# Altium project DARKYDEN.PrjPcb (part 13 of 18)

## Sheet BATTERY_GESTION.SchDoc: DARKYDEN_BATTERY_GESTION
size Letter; ApprovedBy: APPROUVÉ PAR; Author: Harold Malbrouck; Organization: Cegep Limoilou; Address1: 1300, 8e Avenue; Address2: Québec, QC; Address3: Canada; Address4: G1J 5L5; Revision: Rev.F; SheetNumber: 17; SheetTotal: 21
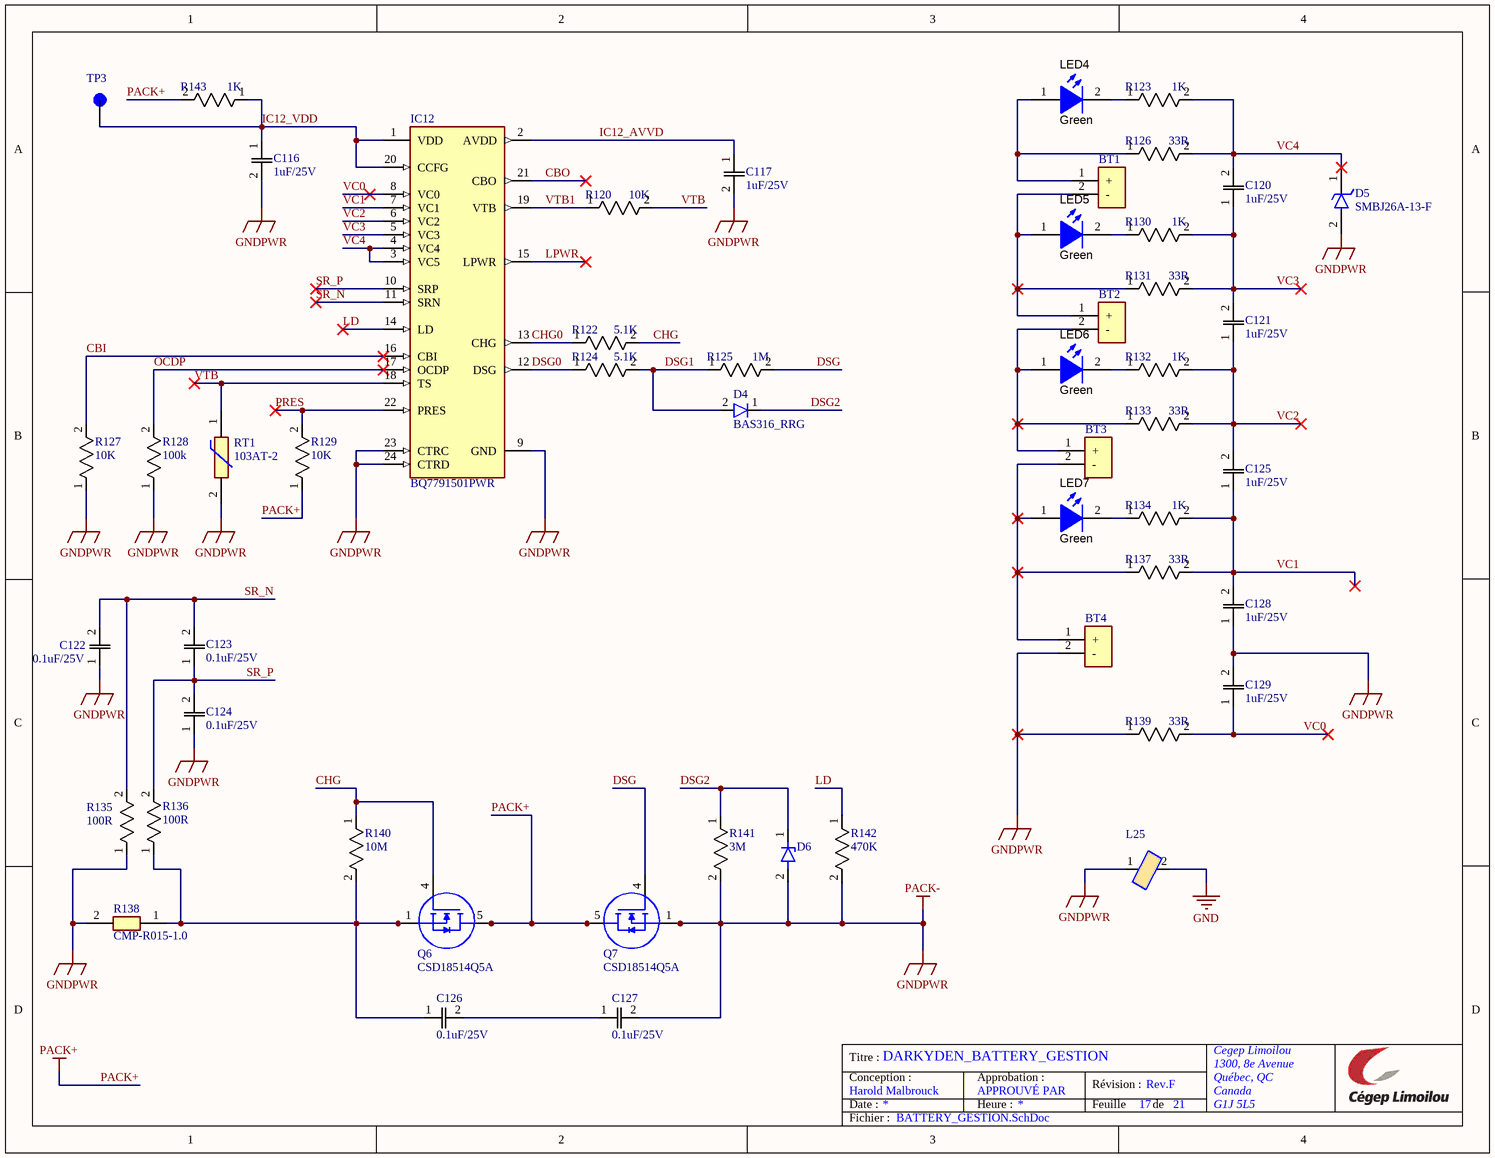
[diagram p12: BATTERY_GESTION.SchDoc]

### Parts
BT1  0530480210  [SHDRRA2W35P0X125_1X2_425X550X350P]  (value not drawn)
BT2  0530480210  [SHDRRA2W35P0X125_1X2_425X550X350P]  (value not drawn)
BT3  0530480210  [SHDRRA2W35P0X125_1X2_425X550X350P]  (value not drawn)
BT4  0530480210  [SHDRRA2W35P0X125_1X2_425X550X350P]  (value not drawn)
C116  1uF/25V  [C0805]
C117  1uF/25V  [C0805]
C120  1uF/25V  [C0805]
C121  1uF/25V  [C0805]
C122  0.1uF/25V  [c0805]
C123  0.1uF/25V  [c0805]
C124  0.1uF/25V  [c0805]
C125  1uF/25V  [C0805]
C126  0.1uF/25V  [c0805]
C127  0.1uF/25V  [c0805]
C128  1uF/25V  [C0805]
C129  1uF/25V  [C0805]
D4  BAS316_RRG  [BAS316RRG]
D5  SMBJ26A-13-F  [DIOM5336X250N]
D6  MMSZ5248B-7-F  [SOD3716X115N]  (value not drawn)
IC12  BQ7791501PWR  [SOP65P640X120-24N]
L25  FBMJ2125HM210NT  [INDC2012X105N]  (value not drawn)
LED4  value Green  [LED_LTST-C190]  (hidden comment: LTST-C190GKT)
LED5  value Green  [LED_LTST-C190]  (hidden comment: LTST-C190GKT)
LED6  value Green  [LED_LTST-C190]  (hidden comment: LTST-C190GKT)
LED7  value Green  [LED_LTST-C190]  (hidden comment: LTST-C190GKT)
Q6  CSD18514Q5A  [CSD18514Q5A]
Q7  CSD18514Q5A  [CSD18514Q5A]
R120  10K  [RESC1608X55N]
R122  5.1K  [RESC1608X55N]
R123  1K  [RESC1608X55N]
R124  5.1K  [RESC1608X55N]
R125  1M  [RESC1608X55N]
R126  33R  [RESC1608X55N]
R127  10K  [RESC1608X55N]
R128  100k  [RESC1608X55N]
R129  10K  [RESC1608X55N]
R130  1K  [RESC1608X55N]
R131  33R  [RESC1608X55N]
R132  1K  [RESC1608X55N]
R133  33R  [RESC1608X55N]
R134  1K  [RESC1608X55N]
R135  100R  [RESC1608X55N]
R136  100R  [RESC1608X55N]
R137  33R  [RESC1608X55N]
R138  CMP-R015-1.0  [RESC5025X70N]
R139  33R  [RESC1608X55N]
R140  10M  [RESC1608X55N]
R141  3M  [RESC1608X55N]
R142  470K  [RESC1608X55N]
R143  1K  [RESC1608X55N]
RT1  103AT-2  [103AT2]
TP3  CHARGE_TP  [KEYSTONE_5006]  (value not drawn)

### Nets
GND: BT4.2(-) C116.2 C117.2 C122.1 C124.1 C127.2 C128.1 C129.2 D5.2(A) D6.2(A) IC12.9(GND) IC12.23(CTRC) IC12.24(CTRD) L25.1 L25.2 Q7.1(S) Q7.2(S_2) Q7.3(S_3) R127.1 R128.1 R135.1 R138.2 R139.1 R141.2 R142.2 RT1.2  [also labelled GNDPWR, PACK-]
PACK+: Q6.5(D) Q6.6(D_2) Q6.7(D_3) Q6.8(D_4) Q6.9(D_5) Q7.5(D) Q7.6(D_2) Q7.7(D_3) Q7.8(D_4) Q7.9(D_5) R129.1 R143.2
CBI: IC12.16(CBI) R127.2
CBO: IC12.21(CBO)
CHG: Q6.4(G) R122.2 R140.1
CHG0: IC12.13(CHG) R122.1
DSG: Q7.4(G) R125.2
DSG0: IC12.12(DSG) R124.1
DSG1: D4.2(A) R124.2 R125.1
DSG2: D4.1(K) D6.1(K) R141.1
IC12_AVVD: C117.1 IC12.2(AVDD)
IC12_VDD: C116.1 IC12.1(VDD) IC12.20(CCFG) R143.1 TP3.TP
LD: IC12.14(LD) R142.1
LPWR: IC12.15(LPWR)
OCDP: IC12.17(OCDP) R128.2
PRES: IC12.22(PRES) R129.2
SR_N: C122.2 C123.2 IC12.11(SRN) R135.2
SR_P: C123.1 C124.2 IC12.10(SRP) R136.2
VC0: C129.1 IC12.8(VC0) R139.2
VC1: C125.1 C128.2 IC12.7(VC1) R134.2 R137.2
VC2: C121.1 C125.2 IC12.6(VC2) R132.2 R133.2
VC3: C120.1 C121.2 IC12.5(VC3) R130.2 R131.2
VC4: C120.2 D5.1(K) IC12.3(VC5) IC12.4(VC4) R123.2 R126.2
VTB: IC12.18(TS) R120.2 RT1.1
VTB1: IC12.19(VTB) R120.1
NetBT1_1: BT1.1(+) LED4.1(A) R126.1
NetBT1_2: BT1.2(-) BT2.1(+) LED5.1(A) R131.1
NetBT2_2: BT2.2(-) BT3.1(+) LED6.1(A) R133.1
NetBT3_2: BT3.2(-) BT4.1(+) LED7.1(A) R137.1
NetC126_1: C126.1 Q6.1(S) Q6.2(S_2) Q6.3(S_3) R136.1 R138.1 R140.2
NetC126_2: C126.2 C127.1
NetLED4_2: LED4.2(K) R123.1
NetLED5_2: LED5.2(K) R130.1
NetLED6_2: LED6.2(K) R132.1
NetLED7_2: LED7.2(K) R134.1

### Notes on the sheet
- Titre :
- Conception :
- Date :
- Approbation :
- Heure :
- Révision :
- Feuille
- de
- Fichier :

### Library data of the parts
BT1-BT4 = Header 1.25MM: Connector; Manufacturer_Name: Molex; Datasheet Link: https://www.molex.com/pdm_docs/sd/530480210_sd.pdf; Height: 3.5mm; Mouser Part Number: N/A; Mouser Price/Stock: https://www.mouser.co.uk/ProductDetail/Molex/0530480210?qs=PBcRNPEHKsoxSi7zGV6Ncw%3D%3D; Arrow Part Number: 0530480210; Arrow Price/Stock: https://www.arrow.com/en/products/0530480210/molex?utm_currency=USD&region=europe; Manufacturer Part Number: 0530480210
C116 C117 C120 C121 C125 C128 C129 = C0805C105K3RACTU: 1 µF, 25 V (DC), ±10 %, SMD 0805, X7R, C0805C105K3RAC7800; Manufacturer_Name: KEMET; Dielectric Material: Ceramic; Material: 4241ConductorMaterial; Value: 1uF; Tolerance: 10%; Voltage: 25V; Datasheet Link: https://content.kemet.com/datasheets/KEM_C1002_X7R_SMD.pdf; Height: 1.1mm; Mouser Part Number: 80-C0805C105K3R; Mouser Price/Stock: https://www.mouser.co.uk/ProductDetail/KEMET/C0805C105K3RACTU?qs=7V%2FSUxyM1Kfm2X%2FN09twSA%3D%3D; Arrow Part Number: C0805C105K3RACTU; Arrow Price/Stock: https://www.arrow.com/en/products/c0805c105k3ractu/kemet-corporation?region=nac; Supplier: Digikey; Supplier Part Number: 399-C0805C105K3RACTUCT-ND; Manufacturer: KEMET; Manufacturer Part Number: C0805C105K3RACTU; RoHS: Yes; Category: Ceramic Capacitors; Stock: 127373; Pricing: 1=0.61, 10=0.498, 100=0.376, 1000=0.30337 (USD); Mounting Technology: Surface Mount; Case/Package: 0805; Pins: 2; Case Code (Imperial): 0805; Case Code (Metric): 2012; Min Operating Temperature: -55°C; Max Operating Temperature: 125°C; Dielectric: X7R; Packaging: Tape and Reel; Termination: SMD/SMT; Package Quantity: 2500; Voltage Rating: 25V; Voltage Rating (DC): 25V; Series: C; Construction: Flat; Length: 2mm; Width: 0.049inch; Depth: 1.25mm; Thickness: 0.055inch; Radiation Hardening: No; Reach SVHC Compliant: No; RoHS Compliant: Yes
C122-C124 C126 C127 = C0805C104K3RACTU: as C94 on sheet POWERSYSTEM; Supplier: Digikey; Supplier Part Number: 399-C0805C104K3RACTUCT-ND; Manufacturer: KEMET; RoHS: Yes; Category: Ceramic Capacitors; Mounting Technology: Surface Mount,PCB; Case/Package: 0805; Pins: 2NUMBER; Case Code (Imperial): 0805; Case Code (Metric): 2012; Min Operating Temperature: -55°C; Max Operating Temperature: 125°C; Packaging: Tape and Reel; Tolerance: 10%; Dielectric: X7R; Termination: SMD/SMT; Package Quantity: 4000; Voltage Rating: 25V; Series: SMD Comm X7R; Voltage Rating (DC): 25V; Construction: Flat; Length: 2mm; Width: 1.2mm; Height: 0.9mm; Depth: 1.25mm; Lead Pitch: 0.75mm; Thickness: 889um; Radiation Hardening: No; RoHS Compliant: Yes; Lead Free: 5697LeadFree; Reach SVHC Compliant: 4186SVHC; ComponentLink1URL: https://datasheet.ciiva.com/7842/kem-c1002-x7r-smd-7842536.pdf?src-supplier=Element14; ComponentLink1Description: https://datasheet.ciiva.com/7842/kem-c1002-x7r-smd-7842536.pdf?src-supplier=Element14; ComponentLink2URL: https://datasheet.ciiva.com/7842/kem-c1002-x7r-smd-7842538.pdf?src-supplier=Element14; ComponentLink2Description: https://datasheet.ciiva.com/7842/kem-c1002-x7r-smd-7842538.pdf?src-supplier=Element14
D4 = BAS316_RRG: Rectifier Diode Small Signal Switching 0.25A 4ns 2-Pin SOD-323 T/R; Manufacturer_Name: Taiwan Semiconductor; Manufacturer Part Number: BAS316 RRG; Max Reverse Voltage (DC): 100V; Average Rectified Current: 250mA; Datasheet Link: https://www.taiwansemi.com/assets/uploads/datasheet/BAS316_E1907.pdf; Height: 1.1mm; Mouser Part Number: 821-BAS316RRG; Mouser Price/Stock: https://www.mouser.co.uk/ProductDetail/Taiwan-Semiconductor/BAS316-RRG?qs=KwaGCOX4wIaA8PMRTc7F4Q%3D%3D; Arrow Part Number: BAS316 RRG; Arrow Price/Stock: https://www.arrow.com/en/products/bas316rrg/taiwan-semiconductor?region=europe; Supplier: Digikey; Supplier Part Number: BAS316RRGCT-ND; Manufacturer: Taiwan Semiconductor; RoHS: Yes; Category: Diodes; Stock: 41621; Pricing: 1=0.11, 10=0.081, 100=0.0564, 500=0.04008, 1000=0.03198 (USD); Mounting Technology: Surface Mount; Series: -; Packaging: Cut Tape; Reverse Recovery Time: 4ns; RoHS Compliant: Yes; ComponentLink1URL: https://www.taiwansemi.com/assets/uploads/datasheet/BAS316_E1907.pdf?src-supplier=Digikey; ComponentLink1Description: https://www.taiwansemi.com/assets/uploads/datasheet/BAS316_E1907.pdf?src-supplier=Digikey; ComponentLink2URL: https://datasheet.octopart.com/BAS316-RRG-Taiwan-Semiconductor-datasheet-166558704.pdf?src-supplier=Future+Electronics; ComponentLink2Description: https://datasheet.octopart.com/BAS316-RRG-Taiwan-Semiconductor-datasheet-166558704.pdf?src-supplier=Future+Electronics
D5 = SMBJ26A-13-F: TVS DIODE 26VWM 42.1VC SMB; Manufacturer_Name: Diodes Incorporated; Datasheet Link: https://www.diodes.com/assets/Datasheets/ds19002.pdf; Height: 2.5mm; Mouser Part Number: 621-SMBJ26A-13-F; Mouser Price/Stock: https://www.mouser.co.uk/ProductDetail/Diodes-Incorporated/SMBJ26A-13-F?qs=gaDBXWSqsDCR7oWfjun1vA%3D%3D; Arrow Part Number: SMBJ26A-13-F; Arrow Price/Stock: https://www.arrow.com/en/products/smbj26a-13-f/diodes-incorporated?region=nac; Manufacturer Part Number: SMBJ26A-13-F
D6 = MMSZ5248B-7-F: Zener Diode 18 V 500 mW ±5% Surface Mount SOD-123; Manufacturer_Name: Multicomp Pro; Datasheet Link: https://componentsearchengine.com/Datasheets/2/MMSZ5248B-7-F.pdf; Height: 1.15mm; Manufacturer Part Number: MMSZ5248B-7-F
IC12 = BQ7791501PWR: /Polymer 3~5 TSSOP-24 Battery Management ICs ROHS; Manufacturer_Name: Texas Instruments; Fault Protection: Over Current,Over Temperature,Short Circuit,Over/Under Voltage; Max Supply Voltage: 25V; Min Supply Voltage: 3V; Number of Cells: 5; Number of Outputs: 1; Output Voltage: 16V; Datasheet Link: https://www.ti.com/lit/gpn/BQ77915; Height: 1.2mm; Mouser Part Number: 595-BQ7791501PWR; Mouser Price/Stock: https://www.mouser.co.uk/ProductDetail/Texas-Instruments/BQ7791501PWR?qs=B6kkDfuK7%2FBYqAWOM%2FFUaQ%3D%3D; Arrow Part Number: BQ7791501PWR; Arrow Price/Stock: null?region=nac; Supplier: Digikey; Supplier Part Number: 296-BQ7791501PWRCT-ND; Manufacturer: Texas Instruments; Manufacturer Part Number: BQ7791501PWR; RoHS: Yes; Category: Battery Management; Stock: 5538; Pricing: 1=1.62, 10=1.183, 25=1.0748, 100=0.9555, 250=0.89868, 500=0.86442, 1000=0.83623 (USD); Mounting Technology: Surface Mount; Case/Package: TSSOP; Pins: 24; Min Operating Temperature: -40°C; Max Operating Temperature: 85°C; Series: -; Length: 7.8mm; Width: 4.4mm; Thickness: 1mm; ComponentLink1URL: http://www.ti.com/general/docs/suppproductinfo.tsp?distId=10&amp;gotoUrl=http%3A%2F%2Fwww.ti.com%2Flit%2Fgpn%2Fbq77915&src-supplier=Digikey; ComponentLink1Description: http://www.ti.com/general/docs/suppproductinfo.tsp?distId=10&amp;gotoUrl=http%3A%2F%2Fwww.ti.com%2Flit%2Fgpn%2Fbq77915&src-supplier=Digikey
L25 = FBMJ2125HM210NT: as L15 on sheet POWERSYSTEM; ComponentLink1URL: https://datasheet.ciiva.com/6212/fbmj2125hm210nt-ss-6212912.pdf?src-supplier=Digikey; RoHS: Yes; ComponentLink1Description: https://datasheet.ciiva.com/6212/fbmj2125hm210nt-ss-6212912.pdf?src-supplier=Digikey; Datasheet Link: https://datasheet.datasheetarchive.com/originals/distributors/Datasheets-DGA6/557945.pdf; Height: 1.05mm; Manufacturer_Name: TAIYO YUDEN; Mouser Part Number: 963-FBMJ2125HM210NT; Mouser Price/Stock: https://www.mouser.co.uk/ProductDetail/TAIYO-YUDEN/FBMJ2125HM210NT?qs=I6KAKw0tg2zeLlwEEK9qzQ%3D%3D; Arrow Part Number: FBMJ2125HM210NT; Arrow Price/Stock: https://www.arrow.com/en/products/fbmj2125hm210nt/taiyo-yuden?region=nac; Supplier: Digikey; Supplier Part Number: 587-1765-1-ND; Manufacturer Part Number: FBMJ2125HM210NT; Category: Ferrite Beads and Chips; Stock: 27778; Pricing: 1=0.11, 10=0.081, 25=0.07, 50=0.063, 100=0.0563, 250=0.04844, 500=0.04302, 1000=0.03801 (USD); Mounting Technology: Surface Mount; Case/Package: 0805; Pins: 2; Core Material: Ferrite; Case Code (Metric): 2012; Case Code (Imperial): 0805; Material: Ferrite; Min Operating Temperature: -40°C; Max Operating Temperature: 125°C; Package Quantity: 4000; Packaging: Tape and Reel; Tolerance: 30%; Max Current Rating: 6A; Max DC Current: 6A; Termination: SMD/SMT; Test Frequency: 100MHz; Series: FB; Frequency: 100MHz; Length: 2mm; Width: 1.25mm; Depth: 1.45mm; RoHS Compliant: Yes; Lead Free: Lead Free; Halogen Free: Halogen Free; Reach SVHC Compliant: Unknown; ComponentLink2URL: https://datasheet.ciiva.com/25614/0900766b810b37be-25614411.pdf?src-supplier=Rs; ComponentLink2Description: https://datasheet.ciiva.com/25614/0900766b810b37be-25614411.pdf?src-supplier=Rs; ComponentLink3URL: https://datasheet.ciiva.com/6212/chipbeads01-e-6212908.pdf?src-supplier=Digikey; ComponentLink3Description: https://datasheet.ciiva.com/6212/chipbeads01-e-6212908.pdf?src-supplier=Digikey; ComponentLink4URL: https://datasheet.ciiva.com/6212/chipbeads01-e-6212907.pdf?src-supplier=Digikey; ComponentLink4Description: https://datasheet.ciiva.com/6212/chipbeads01-e-6212907.pdf?src-supplier=Digikey
LED4-LED7 = LED_Gr_SMD: as LED3 on sheet POWERSYSTEM; CompType: LED; PartNumber: LTST-C190GKT; MountType: SMT; RoHS: Y; PackageReference: 1.6x0.8x0.8mm; Type: ?; Value2: 2.1V; Color: green; ComponentLink1URL: https://sps06.itg.ti.com/sites/KMS/crossdivteams/altium/docs/ComponentDatasheets/LTST-C190GKT.pdf; ComponentLink1Description: Datasheet link; Manufacturer Part Number: LTST-C190GKT
Q6 Q7 = CSD18514Q5A: MOSFET N-Channel 40 V 89A (Tc) 74W (Tc) Surface Mount 8-VSONP (5x6); Manufacturer_Name: Texas Instruments; Datasheet Link: http://www.ti.com/lit/gpn/csd18514q5a; Height: 1.1mm; Mouser Part Number: 595-CSD18514Q5A; Mouser Price/Stock: https://www.mouser.co.uk/ProductDetail/Texas-Instruments/CSD18514Q5A?qs=34RfhUjJmKfubXTJ%252BbkIEA%3D%3D; Arrow Part Number: CSD18514Q5A; Arrow Price/Stock: https://www.arrow.com/en/products/csd18514q5a/texas-instruments?region=nac; Manufacturer Part Number: CSD18514Q5A
R120 R127 R129 = ERJ-3GEYJ103V: as R75-R77 on sheet SystemCTL; Datasheet Link: http://docs-europe.electrocomponents.com/webdocs/13ba/0900766b813ba21b.pdf; Height: 0.55mm; Mouser Part Number: 667-ERJ-3GEYJ103V; Mouser Price/Stock: https://www.mouser.co.uk/ProductDetail/Panasonic/ERJ-3GEYJ103V?qs=66DK8nO8gJBWgc%252B0VNNxzg%3D%3D; Arrow Part Number: ERJ-3GEYJ103V; Arrow Price/Stock: https://www.arrow.com/en/products/erj-3geyj103v/panasonic?region=europe; Supplier: Digikey; Supplier Part Number: P10KGCT-ND; Manufacturer: Panasonic; Manufacturer Part Number: ERJ-3GEYJ103V; RoHS: Yes; Category: Chip SMD Resistors; Stock: 2191587; Pricing: 1=0.1, 10=0.033, 50=0.02, 100=0.0165, 500=0.01096, 1000=0.00939 (USD); Mounting Technology: Surface Mount; Case/Package: 0603; Case Code (Imperial): 0603; Case Code (Metric): 1608; Weight: 7.1E-05oz; Contact Plating: Tin; Min Operating Temperature: -55°C; Max Operating Temperature: 155°C; Tolerance: 5%; Packaging: Tape and Reel; Technology: THICK FILM; Package Quantity: 1; Resistor Type: Thick Film; Termination: SMD/SMT; Number of Terminations: 2; Max Power Dissipation: 100mW; Working Voltage: 75V; Features: Automotive AEC-Q200; Series: ERJ; Construction: Rectangular; Resistance Tolerance: 5%; Length: 1.6mm; Width: 0.8mm; Depth: 0.8mm; Reach SVHC Compliant: No; Military Standard: Not; Lead Free: Lead Free; RoHS Compliant: Yes; ComponentLink1URL: https://datasheet.ciiva.com/11809/0900766b80f806dd-11809566.pdf?src-supplier=Rs; ComponentLink1Description: https://datasheet.ciiva.com/11809/0900766b80f806dd-11809566.pdf?src-supplier=Rs; ComponentLink2URL: https://datasheet.ciiva.com/34303/2007265-34303757.pdf?src-supplier=Jameco; ComponentLink2Description: https://datasheet.ciiva.com/34303/2007265-34303757.pdf?src-supplier=Jameco; ComponentLink3URL: https://datasheet.ciiva.com/48531/aoa0000ce1-48531887.pdf?src-supplier=Avnet; ComponentLink3Description: https://datasheet.ciiva.com/48531/aoa0000ce1-48531887.pdf?src-supplier=Avnet; ComponentLink4URL: https://datasheet.ciiva.com/9117/aoa0000ce1-9117038.pdf?src-supplier=Avnet; ComponentLink4Description: https://datasheet.ciiva.com/9117/aoa0000ce1-9117038.pdf?src-supplier=Avnet; ComponentLink5URL: https://datasheet.ciiva.com/28514/1678796-28514213.pdf?src-supplier=Element14; ComponentLink5Description: https://datasheet.ciiva.com/28514/1678796-28514213.pdf?src-supplier=Element14; ComponentLink6URL: https://datasheet.ciiva.com/46371/1678796-46371909.pdf?src-supplier=Element14; ComponentLink6Description: https://datasheet.ciiva.com/46371/1678796-46371909.pdf?src-supplier=Element14; ComponentLink7URL: https://datasheet.ciiva.com/46385/1678796-46385240.pdf?src-supplier=Element14; ComponentLink7Description: https://datasheet.ciiva.com/46385/1678796-46385240.pdf?src-supplier=Element14; ComponentLink8URL: https://datasheet.ciiva.com/24133/aoa0000ce1-37422-24133064.pdf?src-supplier=Mouser; ComponentLink8Description: https://datasheet.ciiva.com/24133/aoa0000ce1-37422-24133064.pdf?src-supplier=Mouser; ComponentLink9URL: https://datasheet.ciiva.com/16740/aoa0000ce1-16740655.pdf?src-supplier=Future+Electronics; ComponentLink9Description: https://datasheet.ciiva.com/16740/aoa0000ce1-16740655.pdf?src-supplier=Future+Electronics; ComponentLink10URL: https://datasheet.ciiva.com/30147/4aoa0000ce1-30147029.pdf?src-supplier=Onlinecomponents.com; ComponentLink10Description: https://datasheet.ciiva.com/30147/4aoa0000ce1-30147029.pdf?src-supplier=Onlinecomponents.com
R122 R124 = ERA-3ARW512V: 5.1K Ohm 0.05% 0.1W ±10ppm/°C Molded Res Thin Film 0603 SMD Punched Carrier T/R; Manufacturer_Name: Panasonic; Value: 5.1kR; Power Rating: 100mW; Voltage Rating: 75V; Datasheet Link: https://industrial.panasonic.com/cdbs/www-data/pdf/RDM0000/AOA0000C307.pdf; Height: 0.55mm; Mouser Part Number: 667-ERA-3ARW512V; Mouser Price/Stock: https://www.mouser.co.uk/ProductDetail/Panasonic/ERA-3ARW512V?qs=ob%252BdNz2%252BYEinU%2F%252BGAvZ4EA%3D%3D; Supplier: Digikey; Supplier Part Number: P5.1KBECT-ND; Manufacturer: Panasonic; Manufacturer Part Number: ERA-3ARW512V; RoHS: Yes; Category: Chip SMD Resistors; Stock: 12588; Pricing: 1=0.47, 10=0.394, 50=0.345, 100=0.3263, 500=0.28562, 1000=0.2461 (USD); Mounting Technology: Surface Mount; Case/Package: 0603; Case Code (Metric): 1608; Case Code (Imperial): 0603; Weight: 7.1E-05oz; Contact Plating: Tin; Min Operating Temperature: -55°C; Max Operating Temperature: 155°C; Tolerance: 0.05%; Packaging: Tape and Reel; Package Quantity: 1; Number of Terminations: 2; Termination: SMD/SMT; Temperature Coefficient: 10ppm/°C; Max Power Dissipation: 100mW; Features: Automotive AEC-Q200; Series: ERA-3A; Technology: METAL FILM; Voltage Rating (DC): 75V; Length: 1.6mm; Width: 0.8mm; Depth: 0.8mm; Lead Free: Lead Free; RoHS Compliant: Yes; ComponentLink1URL: https://media.digikey.com/pdf/Data%20Sheets/Panasonic%20Resistors%20Thermistors%20PDFs/ERA_Series_LE.pdf?src-supplier=Digikey; ComponentLink1Description: https://media.digikey.com/pdf/Data%20Sheets/Panasonic%20Resistors%20Thermistors%20PDFs/ERA_Series_LE.pdf?src-supplier=Digikey; ComponentLink2URL: http://www.onlinecomponents.com/datasheet/era-3arw512v.aspx?p=44480300&src-supplier=Onlinecomponents.com; ComponentLink2Description: http://www.onlinecomponents.com/datasheet/era-3arw512v.aspx?p=44480300&src-supplier=Onlinecomponents.com; ComponentLink3URL: http://www.alliedelec.com/m/d/b6b0537e86f421aa7f5975bb1d8f429a.pdf?src-supplier=Allied+Electronics; ComponentLink3Description: http://www.alliedelec.com/m/d/b6b0537e86f421aa7f5975bb1d8f429a.pdf?src-supplier=Allied+Electronics; ComponentLink4URL: http://uk.rs-online.com/webdocs/1440/0900766b814408ab.pdf?src-supplier=Rs; ComponentLink4Description: http://uk.rs-online.com/webdocs/1440/0900766b814408ab.pdf?src-supplier=Rs; ComponentLink5URL: http://www.mouser.com/ds/2/315/AOA0000C237-944224.pdf?src-supplier=Mouser; ComponentLink5Description: http://www.mouser.com/ds/2/315/AOA0000C237-944224.pdf?src-supplier=Mouser; ComponentLink6URL: https://industrial.panasonic.com/cdbs/www-data/pdf/RDM0000/AOA0000C307.pdf?src-supplier=Digikey; ComponentLink6Description: https://industrial.panasonic.com/cdbs/www-data/pdf/RDM0000/AOA0000C307.pdf?src-supplier=Digikey; ComponentLink7URL: http://industrial.panasonic.com/www-data/pdf/AOA0000/AOA0000CE26.pdf?src-supplier=Avnet; ComponentLink7Description: http://industrial.panasonic.com/www-data/pdf/AOA0000/AOA0000CE26.pdf?src-supplier=Avnet; ComponentLink8URL: https://datasheet.octopart.com/ERA-3ARW512V-Panasonic-datasheet-33006989.pdf?src-supplier=Electro+Sonic; ComponentLink8Description: https://datasheet.octopart.com/ERA-3ARW512V-Panasonic-datasheet-33006989.pdf?src-supplier=Electro+Sonic; ComponentLink9URL: https://datasheet.octopart.com/ERA-3ARW512V-Panasonic-datasheet-154766165.pdf?src-supplier=Master+Electronics; ComponentLink9Description: https://datasheet.octopart.com/ERA-3ARW512V-Panasonic-datasheet-154766165.pdf?src-supplier=Master+Electronics
R123 R130 R132 R134 R143 = ERJ-3EKF1001V: 1K Ohm 1% 1/10W Res Thick Film 0603 ±100ppm/°C Molded SMD Punched Carrier T/R; Manufacturer_Name: Panasonic; Value: 1kR; Power Rating: 100mW; Voltage Rating: 75V; Datasheet Link: http://industrial.panasonic.com/cdbs/www-data/pdf/RDA0000/AOA0000C86.pdf; Height: 0.55mm; Mouser Part Number: 667-ERJ-3EKF1001V; Mouser Price/Stock: https://www.mouser.co.uk/ProductDetail/Panasonic/ERJ-3EKF1001V?qs=H7k1u0Mp9JTM8yQxOuvoDg%3D%3D; Arrow Part Number: ERJ-3EKF1001V; Arrow Price/Stock: https://www.arrow.com/en/products/erj-3ekf1001v/panasonic?utm_currency=USD&region=europe; Supplier: Digikey; Supplier Part Number: P1.00KHCT-ND; Manufacturer: Panasonic; Manufacturer Part Number: ERJ-3EKF1001V; RoHS: Yes; Category: Chip SMD Resistors; Stock: 1610348; Pricing: 1=0.1, 10=0.035, 100=0.0177, 1000=0.01014, 2500=0.00847 (USD); Mounting Technology: Surface Mount; Case/Package: 0603; Pins: 2; Case Code (Metric): 1608; Case Code (Imperial): 0603; Contact Plating: Tin; Min Operating Temperature: -55°C; Max Operating Temperature: 155°C; Tolerance: 1%; Temperature Coefficient: 100ppm/°C; Packaging: Tape and Reel; Package Quantity: 5000; Resistor Type: Thick Film; Number of Terminations: 2; Termination: SMD/SMT; Max Power Dissipation: 100mW; Voltage Rating (DC): 75V; Features: Automotive AEC-Q200; Series: ERJ; Technology: THICK FILM; Construction: Rectangular; Resistance Tolerance: 1%; Length: 1.6mm; Width: 0.8mm; Depth: 0.8mm; Radiation Hardening: No; Reach SVHC Compliant: No; Military Standard: Not; RoHS Compliant: Yes; ComponentLink1URL: https://datasheet.ciiva.com/48530/aoa0000ce2-48530987.pdf?src-supplier=Avnet; ComponentLink1Description: https://datasheet.ciiva.com/48530/aoa0000ce2-48530987.pdf?src-supplier=Avnet; ComponentLink2URL: https://datasheet.ciiva.com/30063/aoa0000ce2-30063390.pdf?src-supplier=Onlinecomponents.com; ComponentLink2Description: https://datasheet.ciiva.com/30063/aoa0000ce2-30063390.pdf?src-supplier=Onlinecomponents.com; ComponentLink3URL: https://datasheet.ciiva.com/16449/aoa0000ce2-16449065.pdf?src-supplier=Future+Electronics; ComponentLink3Description: https://datasheet.ciiva.com/16449/aoa0000ce2-16449065.pdf?src-supplier=Future+Electronics; ComponentLink4URL: https://datasheet.ciiva.com/22673/1678782-22673918.pdf?src-supplier=Element14; ComponentLink4Description: https://datasheet.ciiva.com/22673/1678782-22673918.pdf?src-supplier=Element14; ComponentLink5URL: https://datasheet.ciiva.com/16768/70260748-16768437.pdf?src-supplier=Allied+Electronics; ComponentLink5Description: https://datasheet.ciiva.com/16768/70260748-16768437.pdf?src-supplier=Allied+Electronics; ComponentLink6URL: https://datasheet.ciiva.com/16774/70260748-16774550.pdf?src-supplier=Allied+Electronics; ComponentLink6Description: https://datasheet.ciiva.com/16774/70260748-16774550.pdf?src-supplier=Allied+Electronics; ComponentLink7URL: https://datasheet.ciiva.com/46373/1678782-46373339.pdf?src-supplier=Element14; ComponentLink7Description: https://datasheet.ciiva.com/46373/1678782-46373339.pdf?src-supplier=Element14; ComponentLink8URL: https://datasheet.ciiva.com/46373/1678782-46373340.pdf?src-supplier=Element14; ComponentLink8Description: https://datasheet.ciiva.com/46373/1678782-46373340.pdf?src-supplier=Element14; ComponentLink9URL: https://datasheet.ciiva.com/7942/aoa0000ce2-7942427.pdf?src-supplier=Element14; ComponentLink9Description: https://datasheet.ciiva.com/7942/aoa0000ce2-7942427.pdf?src-supplier=Element14; ComponentLink10URL: https://datasheet.ciiva.com/9198/aoa0000ce2-9198923.pdf?src-supplier=Avnet; ComponentLink10Description: https://datasheet.ciiva.com/9198/aoa0000ce2-9198923.pdf?src-supplier=Avnet; ComponentLink11URL: https://datasheet.ciiva.com/24070/aoa0000ce2-24070269.pdf?src-supplier=Mouser; ComponentLink11Description: https://datasheet.ciiva.com/24070/aoa0000ce2-24070269.pdf?src-supplier=Mouser
R125 = ERJ-3GEYJ105V: 1M Ohm Res Thick Film 0603 5% 0.1W(1/10W) +/-200ppm/ßC SMD Automotive T/R; Manufacturer_Name: Panasonic; Value: 1MR; Power Rating: 100mW; Voltage Rating: 75V; Temperature Coefficient: 200ppm/°C; Datasheet Link: http://docs-europe.electrocomponents.com/webdocs/13ba/0900766b813ba21b.pdf; Height: 0.55mm; Mouser Part Number: 667-ERJ-3GEYJ105V; Mouser Price/Stock: https://www.mouser.co.uk/ProductDetail/Panasonic/ERJ-3GEYJ105V?qs=66DK8nO8gJAFuT6JGu2rQw%3D%3D; Arrow Part Number: ERJ-3GEYJ105V; Arrow Price/Stock: https://www.arrow.com/en/products/erj-3geyj105v/panasonic?region=nac; Supplier: Digikey; Supplier Part Number: P1.0MGCT-ND; Manufacturer: Panasonic; Manufacturer Part Number: ERJ-3GEYJ105V; RoHS: Yes; Category: Chip SMD Resistors; Stock: 339054; Pricing: 1=0.1, 10=0.033, 50=0.02, 100=0.0165, 500=0.01096, 1000=0.00939 (USD); Mounting Technology: Surface Mount; Case/Package: 0603; Case Code (Imperial): 0603; Case Code (Metric): 1608; Weight: 7.1E-05oz; Contact Plating: Tin; Min Operating Temperature: -55°C; Max Operating Temperature: 155°C; Packaging: Tape and Reel; Tolerance: 5%; Package Quantity: 1; Resistor Type: Thick Film; Termination: SMD/SMT; Number of Terminations: 2; Max Power Dissipation: 100mW; Features: Automotive AEC-Q200; Series: ERJ; Resistance Tolerance: 5%; Construction: Rectangular; Technology: THICK FILM; Length: 1.6mm; Width: 0.8mm; Depth: 0.8mm; Radiation Hardening: No; Military Standard: Not; Lead Free: Lead Free; RoHS Compliant: Yes; Reach SVHC Compliant: Unknown; ComponentLink1URL: https://datasheet.ciiva.com/11821/0900766b80f806dd-11821431.pdf?src-supplier=Rs; ComponentLink1Description: https://datasheet.ciiva.com/11821/0900766b80f806dd-11821431.pdf?src-supplier=Rs; ComponentLink2URL: https://datasheet.ciiva.com/24160/aoa0000ce1-37422-24160165.pdf?src-supplier=Mouser; ComponentLink2Description: https://datasheet.ciiva.com/24160/aoa0000ce1-37422-24160165.pdf?src-supplier=Mouser; ComponentLink3URL: https://datasheet.ciiva.com/9117/aoa0000ce1-9117049.pdf?src-supplier=Avnet; ComponentLink3Description: https://datasheet.ciiva.com/9117/aoa0000ce1-9117049.pdf?src-supplier=Avnet
R126 R131 R133 R137 R139 = ERJ-3EKF33R0V: as R78 on sheet SystemCTL; Supplier: Digikey; Supplier Part Number: P33.0HCT-ND; Manufacturer: Panasonic; Manufacturer Part Number: ERJ-3EKF33R0V; RoHS: Yes; Category: Chip SMD Resistors; Stock: 430721; Pricing: 1=0.1, 10=0.035, 100=0.0177, 1000=0.01014, 2500=0.00888 (USD); Mounting Technology: Surface Mount; Case/Package: 0603; Pins: 2; Case Code (Metric): 1608; Case Code (Imperial): 0603; Contact Plating: Tin; Min Operating Temperature: -55°C; Max Operating Temperature: 155°C; Value: 33R; Tolerance: 1%; Packaging: Tape and Reel; Package Quantity: 1; Resistor Type: Thick Film; Number of Terminations: 2; Temperature Coefficient: 100ppm/°C; Termination: SMD/SMT; Max Power Dissipation: 100mW; Voltage Rating (DC): 75V; Features: Automotive AEC-Q200; Series: ERJ; Construction: Rectangular; Resistance Tolerance: 1%; Length: 1.6mm; Width: 0.8mm; Height: 0.022inch; Depth: 0.8mm; Radiation Hardening: No; Reach SVHC Compliant: No; Military Standard: Not; Lead Free: Lead Free; RoHS Compliant: Yes; ComponentLink1URL: https://datasheet.ciiva.com/5917/aoa0000ce2-5917831.pdf?src-supplier=Farnell; ComponentLink1Description: https://datasheet.ciiva.com/5917/aoa0000ce2-5917831.pdf?src-supplier=Farnell; ComponentLink2URL: https://datasheet.ciiva.com/48531/aoa0000ce2-48531007.pdf?src-supplier=Avnet; ComponentLink2Description: https://datasheet.ciiva.com/48531/aoa0000ce2-48531007.pdf?src-supplier=Avnet; ComponentLink3URL: https://datasheet.ciiva.com/30250/aoa0000ce2-30250862.pdf?src-supplier=Onlinecomponents.com; ComponentLink3Description: https://datasheet.ciiva.com/30250/aoa0000ce2-30250862.pdf?src-supplier=Onlinecomponents.com; ComponentLink4URL: https://datasheet.ciiva.com/16778/70260748-16778478.pdf?src-supplier=Allied+Electronics; ComponentLink4Description: https://datasheet.ciiva.com/16778/70260748-16778478.pdf?src-supplier=Allied+Electronics; ComponentLink5URL: https://datasheet.ciiva.com/16781/70260748-16781237.pdf?src-supplier=Allied+Electronics; ComponentLink5Description: https://datasheet.ciiva.com/16781/70260748-16781237.pdf?src-supplier=Allied+Electronics; ComponentLink6URL: https://datasheet.ciiva.com/22673/1678782-22673288.pdf?src-supplier=Element14; ComponentLink6Description: https://datasheet.ciiva.com/22673/1678782-22673288.pdf?src-supplier=Element14; ComponentLink7URL: https://datasheet.ciiva.com/24026/aoa0000ce2-24026635.pdf?src-supplier=Mouser; ComponentLink7Description: https://datasheet.ciiva.com/24026/aoa0000ce2-24026635.pdf?src-supplier=Mouser; ComponentLink8URL: https://datasheet.ciiva.com/22687/1678782-22687390.pdf?src-supplier=Element14; ComponentLink8Description: https://datasheet.ciiva.com/22687/1678782-22687390.pdf?src-supplier=Element14; ComponentLink9URL: https://datasheet.ciiva.com/7836/aoa0000ce2-7836503.pdf?src-supplier=Element14; ComponentLink9Description: https://datasheet.ciiva.com/7836/aoa0000ce2-7836503.pdf?src-supplier=Element14; ComponentLink10URL: https://datasheet.ciiva.com/7836/426256-7836821.pdf?src-supplier=Element14; ComponentLink10Description: https://datasheet.ciiva.com/7836/426256-7836821.pdf?src-supplier=Element14
R128 = ERJ-3GEYJ104V: as R114 on sheet POWERSYSTEM; Datasheet Link: http://docs-europe.electrocomponents.com/webdocs/13ba/0900766b813ba21b.pdf; Height: 0.55mm; Mouser Part Number: 667-ERJ-3GEYJ104V; Mouser Price/Stock: https://www.mouser.co.uk/ProductDetail/Panasonic/ERJ-3GEYJ104V?qs=66DK8nO8gJC7IhSuep78kw%3D%3D; Arrow Part Number: ERJ-3GEYJ104V; Arrow Price/Stock: https://www.arrow.com/en/products/erj-3geyj104v/panasonic?region=nac; Supplier: Digikey; Supplier Part Number: P100KGCT-ND; Manufacturer: Panasonic; Manufacturer Part Number: ERJ-3GEYJ104V; RoHS: Yes; Category: Chip SMD Resistors; Stock: 248896; Pricing: 1=0.1, 10=0.033, 50=0.02, 100=0.0165, 500=0.01096, 1000=0.00939 (USD); Mounting Technology: Surface Mount; Case/Package: 0603; Case Code (Imperial): 0603; Case Code (Metric): 1608; Weight: 7.1E-05oz; Contact Plating: Tin; Min Operating Temperature: -55°C; Max Operating Temperature: 155°C; Tolerance: 5%; Packaging: Tape and Reel; Package Quantity: 1; Resistor Type: Thick Film; Termination: SMD/SMT; Number of Terminations: 2; Max Power Dissipation: 100mW; Features: Automotive AEC-Q200; Series: ERJ; Construction: Rectangular; Resistance Tolerance: 5%; Technology: THICK FILM; Length: 1.6mm; Width: 0.8mm; Depth: 0.8mm; Reach SVHC Compliant: No; Military Standard: Not; RoHS Compliant: Yes; ComponentLink1URL: https://datasheet.ciiva.com/11809/0900766b80f806dd-11809567.pdf?src-supplier=Rs; ComponentLink1Description: https://datasheet.ciiva.com/11809/0900766b80f806dd-11809567.pdf?src-supplier=Rs; ComponentLink2URL: https://datasheet.ciiva.com/22758/1678796-22758220.pdf?src-supplier=Farnell; ComponentLink2Description: https://datasheet.ciiva.com/22758/1678796-22758220.pdf?src-supplier=Farnell; ComponentLink3URL: https://datasheet.ciiva.com/43460/1678796-43460761.pdf?src-supplier=Farnell; ComponentLink3Description: https://datasheet.ciiva.com/43460/1678796-43460761.pdf?src-supplier=Farnell; ComponentLink4URL: https://datasheet.ciiva.com/24159/aoa0000ce1-37422-24159717.pdf?src-supplier=Mouser; ComponentLink4Description: https://datasheet.ciiva.com/24159/aoa0000ce1-37422-24159717.pdf?src-supplier=Mouser; ComponentLink5URL: https://datasheet.ciiva.com/46380/1678796-46380412.pdf?src-supplier=Element14; ComponentLink5Description: https://datasheet.ciiva.com/46380/1678796-46380412.pdf?src-supplier=Element14; ComponentLink6URL: https://datasheet.ciiva.com/46389/1678796-46389629.pdf?src-supplier=Element14; ComponentLink6Description: https://datasheet.ciiva.com/46389/1678796-46389629.pdf?src-supplier=Element14; ComponentLink7URL: https://datasheet.ciiva.com/27055/1988495-27055706.pdf?src-supplier=Jameco; ComponentLink7Description: https://datasheet.ciiva.com/27055/1988495-27055706.pdf?src-supplier=Jameco; ComponentLink8URL: https://datasheet.ciiva.com/16762/70255313-16762591.pdf?src-supplier=Allied+Electronics; ComponentLink8Description: https://datasheet.ciiva.com/16762/70255313-16762591.pdf?src-supplier=Allied+Electronics; ComponentLink9URL: https://datasheet.ciiva.com/16508/aoa0000ce1-16508383.pdf?src-supplier=Future+Electronics; ComponentLink9Description: https://datasheet.ciiva.com/16508/aoa0000ce1-16508383.pdf?src-supplier=Future+Electronics
R135 R136 = ERJ-3EKF1000V: as R70-R73 on sheet SystemCTL; Datasheet Link: http://industrial.panasonic.com/cdbs/www-data/pdf/RDA0000/AOA0000C86.pdf; Height: 0.55mm; Mouser Part Number: 667-ERJ-3EKF1000V; Mouser Price/Stock: https://www.mouser.co.uk/ProductDetail/Panasonic/ERJ-3EKF1000V?qs=H7k1u0Mp9JS7i8KGO5m47A%3D%3D; Arrow Part Number: ERJ-3EKF1000V; Arrow Price/Stock: https://www.arrow.com/en/products/erj-3ekf1000v/panasonic?utm_currency=USD&region=nac; Supplier: Digikey; Supplier Part Number: P100HCT-ND; Manufacturer: Panasonic; Manufacturer Part Number: ERJ-3EKF1000V; RoHS: Yes; Category: Chip SMD Resistors; Stock: 1036225; Pricing: 1=0.1, 10=0.035, 100=0.0177, 1000=0.01014, 2500=0.00888 (USD); Mounting Technology: Surface Mount; Case/Package: 0603; Contact Plating: Tin; Case Code (Imperial): 0603; Case Code (Metric): 1608; Weight: 7.1E-05oz; Min Operating Temperature: -55°C; Max Operating Temperature: 155°C; Packaging: Tape and Reel; Package Quantity: 5000; Termination: SMD/SMT; Series: ERJ; Value: 100R; Tolerance: 1%; Resistor Type: Thick Film; Number of Terminations: 2; Temperature Coefficient: 100ppm/°C; Max Power Dissipation: 100mW; Voltage Rating (DC): 75V; Features: Automotive AEC-Q200; Resistance Tolerance: 1%; Construction: Rectangular; Length: 1.6mm; Width: 0.8mm; Depth: 0.8mm; Radiation Hardening: No; Reach SVHC Compliant: No; Lead Free: Lead Free; RoHS Compliant: Yes; Military Standard: Not; ComponentLink1URL: https://datasheet.ciiva.com/34303/1987450-34303565.pdf?src-supplier=Jameco; ComponentLink1Description: https://datasheet.ciiva.com/34303/1987450-34303565.pdf?src-supplier=Jameco; ComponentLink2URL: https://datasheet.ciiva.com/9186/aoa0000ce2-9186725.pdf?src-supplier=Avnet; ComponentLink2Description: https://datasheet.ciiva.com/9186/aoa0000ce2-9186725.pdf?src-supplier=Avnet; ComponentLink3URL: https://datasheet.ciiva.com/48530/aoa0000ce2-48530986.pdf?src-supplier=Avnet; ComponentLink3Description: https://datasheet.ciiva.com/48530/aoa0000ce2-48530986.pdf?src-supplier=Avnet; ComponentLink4URL: https://datasheet.ciiva.com/7830/aoa0000ce2-7830728.pdf?src-supplier=Element14; ComponentLink4Description: https://datasheet.ciiva.com/7830/aoa0000ce2-7830728.pdf?src-supplier=Element14; ComponentLink5URL: https://datasheet.ciiva.com/22667/1678782-22667887.pdf?src-supplier=Element14; ComponentLink5Description: https://datasheet.ciiva.com/22667/1678782-22667887.pdf?src-supplier=Element14; ComponentLink6URL: https://datasheet.ciiva.com/46372/1678782-46372726.pdf?src-supplier=Element14; ComponentLink6Description: https://datasheet.ciiva.com/46372/1678782-46372726.pdf?src-supplier=Element14; ComponentLink7URL: https://datasheet.ciiva.com/46372/1678782-46372727.pdf?src-supplier=Element14; ComponentLink7Description: https://datasheet.ciiva.com/46372/1678782-46372727.pdf?src-supplier=Element14; ComponentLink8URL: https://datasheet.ciiva.com/24159/aoa0000ce2-24159753.pdf?src-supplier=Mouser; ComponentLink8Description: https://datasheet.ciiva.com/24159/aoa0000ce2-24159753.pdf?src-supplier=Mouser; ComponentLink9URL: https://datasheet.ciiva.com/16765/70260748-16765766.pdf?src-supplier=Allied+Electronics; ComponentLink9Description: https://datasheet.ciiva.com/16765/70260748-16765766.pdf?src-supplier=Allied+Electronics; ComponentLink10URL: https://datasheet.ciiva.com/16762/70260748-16762666.pdf?src-supplier=Allied+Electronics; ComponentLink10Description: https://datasheet.ciiva.com/16762/70260748-16762666.pdf?src-supplier=Allied+Electronics; ComponentLink11URL: https://datasheet.ciiva.com/30088/aoa0000ce2-30088649.pdf?src-supplier=Onlinecomponents.com; ComponentLink11Description: https://datasheet.ciiva.com/30088/aoa0000ce2-30088649.pdf?src-supplier=Onlinecomponents.com
R138 = Resistor 2010: Package 2010; Manufacturer_Name: Vishay; Manufacturer Part Number: CRCW20100000Z0EFHP; Datasheet Link: http://www.vishay.com/docs/20043/crcwhpe3.pdf; Height: 0.7mm; Mouser Part Number: 71-CRCW20100000Z0EFH; Mouser Price/Stock: https://www.mouser.co.uk/ProductDetail/Vishay-Dale/CRCW20100000Z0EFHP?qs=k2%2FDWSARqgGSaNuPGbWcpw%3D%3D; Arrow Part Number: CRCW20100000Z0EFHP; Arrow Price/Stock: https://www.arrow.com/en/products/crcw20100000z0efhp/vishay?region=nac
R140 = ERJ-U03J106V: 10Mohm 5%  SMD 0603   Anti-Sulfur AEC-Q200; Manufacturer_Name: Panasonic; Value: 10MR; Power Rating: 100mW; Voltage Rating: 75V; Current Rating: 1A; Datasheet Link: http://industrial.panasonic.com/cdbs/www-data/pdf/RDP0000/AOA0000C334.pdf; Height: 0.55mm; Mouser Part Number: 667-ERJ-U03J106V; Mouser Price/Stock: https://www.mouser.co.uk/ProductDetail/Panasonic/ERJ-U03J106V?qs=pdFhdcvjjgjSJSqKhYCfQg%3D%3D; Supplier: Digikey; Supplier Part Number: 10-ERJ-U03J106VCT-ND; Manufacturer: Panasonic; Manufacturer Part Number: ERJ-U03J106V; RoHS: Yes; Category: Chip SMD Resistors; Stock: 15102; Pricing: 1=0.11, 10=0.053, 50=0.0336, 100=0.0282, 500=0.0197, 1000=0.01726 (USD); Case/Package: 0603; Case Code (Imperial): 0603; Case Code (Metric): 1608; Weight: 7.1E-05oz; Min Operating Temperature: -55°C; Max Operating Temperature: 155°C; Tolerance: 5%; Packaging: Tape and Reel; Package Quantity: 5000; Termination: SMD/SMT; Series: ERJ-U03; Length: 1.6mm; Width: 0.8mm; ComponentLink1URL: https://datasheet.ciiva.com/24170/ras-erj-u-267552-24170485.pdf?src-supplier=Mouser; ComponentLink1Description: https://datasheet.ciiva.com/24170/ras-erj-u-267552-24170485.pdf?src-supplier=Mouser
R141 = ERJ-3GEYJ305V: 3M Ohm 5% 1/10W Res Thick Film 0603 -400ppm/¦¦; Manufacturer_Name: Panasonic; Value: 3MR; Power Rating: 100mW; Voltage Rating: 75V; Temperature Coefficient: 150ppm/°C; Datasheet Link: http://docs-europe.electrocomponents.com/webdocs/13ba/0900766b813ba21b.pdf; Height: 0.55mm; Mouser Part Number: 667-ERJ-3GEYJ305V; Supplier: Digikey; Supplier Part Number: P3.0MGCT-ND; Manufacturer: Panasonic; Manufacturer Part Number: ERJ-3GEYJ305V; RoHS: Yes; Category: Chip SMD Resistors; Stock: 29466; Pricing: 1=0.1, 10=0.033, 50=0.0202, 100=0.0166, 500=0.01102, 1000=0.00944 (USD); Mounting Technology: Surface Mount; Case/Package: 0603; Case Code (Metric): 1608; Case Code (Imperial): 0603; Weight: 7.1E-05oz; Contact Plating: Tin; Min Operating Temperature: -55°C; Max Operating Temperature: 155°C; Tolerance: 5%; Packaging: Tape and Reel; Package Quantity: 1; Resistor Type: Thick Film; Number of Terminations: 2; Termination: SMD/SMT; Max Power Dissipation: 100mW; Features: Automotive AEC-Q200; Series: ERJ; Resistance Tolerance: 5%; Technology: THICK FILM; Construction: Rectangular; Length: 1.6mm; Width: 0.8mm; Depth: 0.8mm; Reach SVHC Compliant: No; Military Standard: Not; RoHS Compliant: Yes; ComponentLink1URL: https://datasheet.ciiva.com/43460/1500035-43460793.pdf?src-supplier=Farnell; ComponentLink1Description: https://datasheet.ciiva.com/43460/1500035-43460793.pdf?src-supplier=Farnell; ComponentLink2URL: https://datasheet.ciiva.com/24124/aoa0000ce1-37422-24124297.pdf?src-supplier=Mouser; ComponentLink2Description: https://datasheet.ciiva.com/24124/aoa0000ce1-37422-24124297.pdf?src-supplier=Mouser; ComponentLink3URL: https://datasheet.ciiva.com/46377/1500035-46377147.pdf?src-supplier=Element14; ComponentLink3Description: https://datasheet.ciiva.com/46377/1500035-46377147.pdf?src-supplier=Element14; ComponentLink4URL: https://datasheet.ciiva.com/30248/4aoa0000ce1-30248491.pdf?src-supplier=Onlinecomponents.com; ComponentLink4Description: https://datasheet.ciiva.com/30248/4aoa0000ce1-30248491.pdf?src-supplier=Onlinecomponents.com; ComponentLink5URL: https://datasheet.ciiva.com/28693/1678796-28693385.pdf?src-supplier=Element14; ComponentLink5Description: https://datasheet.ciiva.com/28693/1678796-28693385.pdf?src-supplier=Element14; ComponentLink6URL: https://datasheet.ciiva.com/16767/70255313-16767708.pdf?src-supplier=Allied+Electronics; ComponentLink6Description: https://datasheet.ciiva.com/16767/70255313-16767708.pdf?src-supplier=Allied+Electronics; ComponentLink7URL: https://datasheet.ciiva.com/16788/70255313-16788695.pdf?src-supplier=Allied+Electronics; ComponentLink7Description: https://datasheet.ciiva.com/16788/70255313-16788695.pdf?src-supplier=Allied+Electronics
R142 = ERJ-3EKF4703V: 470K Ohm 1% 0.1W  Res Thick Film 0603 ±100ppm/°C Molded SMD Punched Carrier T/R; Manufacturer_Name: Panasonic; Voltage Rating: 75V; Value: 470kR; Power Rating: 100mW; Interface: SPI; Max Supply Voltage: 3.6V; Min Supply Voltage: 1.65V; Nominal Supply Current: 15mA; Nominal Supply Voltage (DC): 1.8V; Datasheet Link: http://industrial.panasonic.com/cdbs/www-data/pdf/RDA0000/AOA0000C86.pdf; Height: 0.55mm; Mouser Part Number: 667-ERJ-3EKF4703V; Mouser Price/Stock: https://www.mouser.co.uk/ProductDetail/Panasonic/ERJ-3EKF4703V?qs=MVjVSMjNRMpDf0g74YJtlg%3D%3D; Arrow Part Number: ERJ-3EKF4703V; Arrow Price/Stock: https://www.arrow.com/en/products/erj-3ekf4703v/panasonic?utm_currency=USD&region=nac; Supplier: Digikey; Supplier Part Number: P470KHCT-ND; Manufacturer: Panasonic; Manufacturer Part Number: ERJ-3EKF4703V; RoHS: Yes; Category: Chip SMD Resistors; Stock: 160774; Pricing: 1=0.1, 10=0.035, 100=0.0177, 1000=0.01014, 2500=0.00847 (USD); Mounting Technology: Surface Mount; Case/Package: 0603; Case Code (Imperial): 0603; Case Code (Metric): 1608; Contact Plating: Tin; Min Operating Temperature: -55°C; Max Operating Temperature: 155°C; Packaging: Tape and Reel; Tolerance: 1%; Package Quantity: 1; Termination: SMD/SMT; Resistor Type: Thick Film; Number of Terminations: 2; Temperature Coefficient: 100ppm/°C; Max Power Dissipation: 100mW; Voltage Rating (DC): 75V; Features: Automotive AEC-Q200; Series: ERJ; Resistance Tolerance: 1%; Construction: Rectangular; Length: 1.6mm; Width: 0.8mm; Depth: 0.8mm; Radiation Hardening: No; Reach SVHC Compliant: No; Military Standard: Not; Lead Free: Lead Free; RoHS Compliant: Yes; ComponentLink1URL: https://datasheet.ciiva.com/9117/aoa0000ce2-9117093.pdf?src-supplier=Avnet; ComponentLink1Description: https://datasheet.ciiva.com/9117/aoa0000ce2-9117093.pdf?src-supplier=Avnet; ComponentLink2URL: https://datasheet.ciiva.com/9181/aoa0000ce2-9181725.pdf?src-supplier=Avnet; ComponentLink2Description: https://datasheet.ciiva.com/9181/aoa0000ce2-9181725.pdf?src-supplier=Avnet; ComponentLink3URL: https://datasheet.ciiva.com/22687/1678782-22687437.pdf?src-supplier=Element14; ComponentLink3Description: https://datasheet.ciiva.com/22687/1678782-22687437.pdf?src-supplier=Element14; ComponentLink4URL: https://datasheet.ciiva.com/16759/70260748-16759934.pdf?src-supplier=Allied+Electronics; ComponentLink4Description: https://datasheet.ciiva.com/16759/70260748-16759934.pdf?src-supplier=Allied+Electronics; ComponentLink5URL: https://datasheet.ciiva.com/16786/70260748-16786907.pdf?src-supplier=Allied+Electronics; ComponentLink5Description: https://datasheet.ciiva.com/16786/70260748-16786907.pdf?src-supplier=Allied+Electronics; ComponentLink6URL: https://datasheet.ciiva.com/46444/1678782-46444813.pdf?src-supplier=Element14; ComponentLink6Description: https://datasheet.ciiva.com/46444/1678782-46444813.pdf?src-supplier=Element14; ComponentLink7URL: https://datasheet.ciiva.com/46444/1678782-46444814.pdf?src-supplier=Element14; ComponentLink7Description: https://datasheet.ciiva.com/46444/1678782-46444814.pdf?src-supplier=Element14; ComponentLink8URL: https://datasheet.ciiva.com/7836/aoa0000ce2-7836505.pdf?src-supplier=Element14; ComponentLink8Description: https://datasheet.ciiva.com/7836/aoa0000ce2-7836505.pdf?src-supplier=Element14
RT1 = 103AT-2: NTC Thermistor 10k Bead; Manufacturer_Name: Semitec; Datasheet Link: https://www.semitec-global.com/uploads/2022/01/P12-13-AT-Thermistor.pdf; Height: 9.5mm; Mouser Part Number: 954-103AT-2; Mouser Price/Stock: https://www.mouser.co.uk/ProductDetail/Semitec/103AT-2?qs=wgO0AD0o1vvcDzsKguD%252Bew%3D%3D; Manufacturer Part Number: 103AT-2
TP3 = 5006: Test Point Compact THM PC .350 L .125 OD Heat Resistant Nylon 46 Black | Keystone Electronics 5006; MF: Keystone Electronics Corp.; SnapEDA_Link: https://www.snapeda.com/parts/5006/Keystone/view-part/?ref=snap; Package: NON STANDARD-1 Keystone; Value: *; MP: 5006; Manufacturer Part Number: 5006